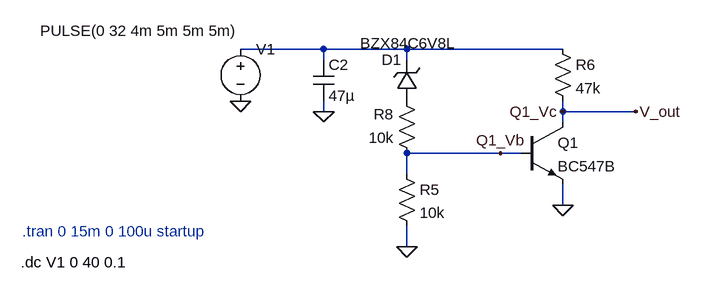
[diagram p0: schematic low_power_cutoff.asc]
low_power_cutoff.asc, the LTspice schematic file:
Version 4
SHEET 1 904 680
WIRE -816 224 -944 224
WIRE -688 224 -816 224
WIRE -448 224 -688 224
WIRE -816 240 -816 224
WIRE -688 240 -688 224
WIRE -816 320 -816 304
WIRE -448 320 -448 304
WIRE -336 320 -448 320
WIRE -448 336 -448 320
WIRE -544 384 -688 384
WIRE -512 384 -544 384
WIRE -688 416 -688 384
WIRE -448 464 -448 432
WIRE -688 528 -688 496
FLAG -816 320 0
FLAG -448 320 Q1_Vc
FLAG -544 384 Q1_Vb
FLAG -448 464 0
FLAG -944 304 0
FLAG -688 528 0
FLAG -336 320 V_out
SYMBOL cap -832 240 R0
SYMATTR InstName C2
SYMATTR Value 47µ
SYMATTR SpiceLine V=35
SYMBOL zener -672 304 R180
WINDOW 0 24 64 Left 2
WINDOW 3 -59 89 Left 2
SYMATTR InstName D1
SYMATTR Value BZX84C6V8L
SYMBOL npn -512 336 R0
SYMATTR InstName Q1
SYMATTR Value BC547B
SYMBOL res -464 208 R0
SYMATTR InstName R6
SYMATTR Value 47k
SYMBOL res -672 400 R180
WINDOW 0 36 76 Left 2
WINDOW 3 36 40 Left 2
SYMATTR InstName R8
SYMATTR Value 10k
SYMBOL voltage -944 208 R0
WINDOW 123 0 0 Left 0
WINDOW 3 -308 -12 Left 2
SYMATTR Value PULSE(0 32 4m 5m 5m 5m)
SYMATTR InstName V1
SYMATTR SpiceLine Rser=0.1
SYMBOL res -704 400 R0
SYMATTR InstName R5
SYMATTR Value 10k
TEXT -1280 504 Left 2 ;.tran 0 15m 0 100u startup
TEXT -1282 552 Left 2 !.dc V1 0 40 0.1

The netlist it stands for:
* low_power_cutoff.asc
C2 N001 0 47µ V=35
D1 P001 N001 BZX84C6V8L
Q1 V_out Q1_Vb 0 0 BC547B
R6 N001 V_out 47k
R8 Q1_Vb P001 10k
V1 N001 0 PULSE(0 32 4m 5m 5m 5m) Rser=0.1
R5 Q1_Vb 0 10k
.model D D
.lib standard.dio
.model NPN NPN
.model PNP PNP
.lib standard.bjt
* .tran 0 15m 0 100u startup
.dc V1 0 40 0.1
.backanno
.end